# Altium schematic sheet Front_DisplayKey.SchDoc
size A4
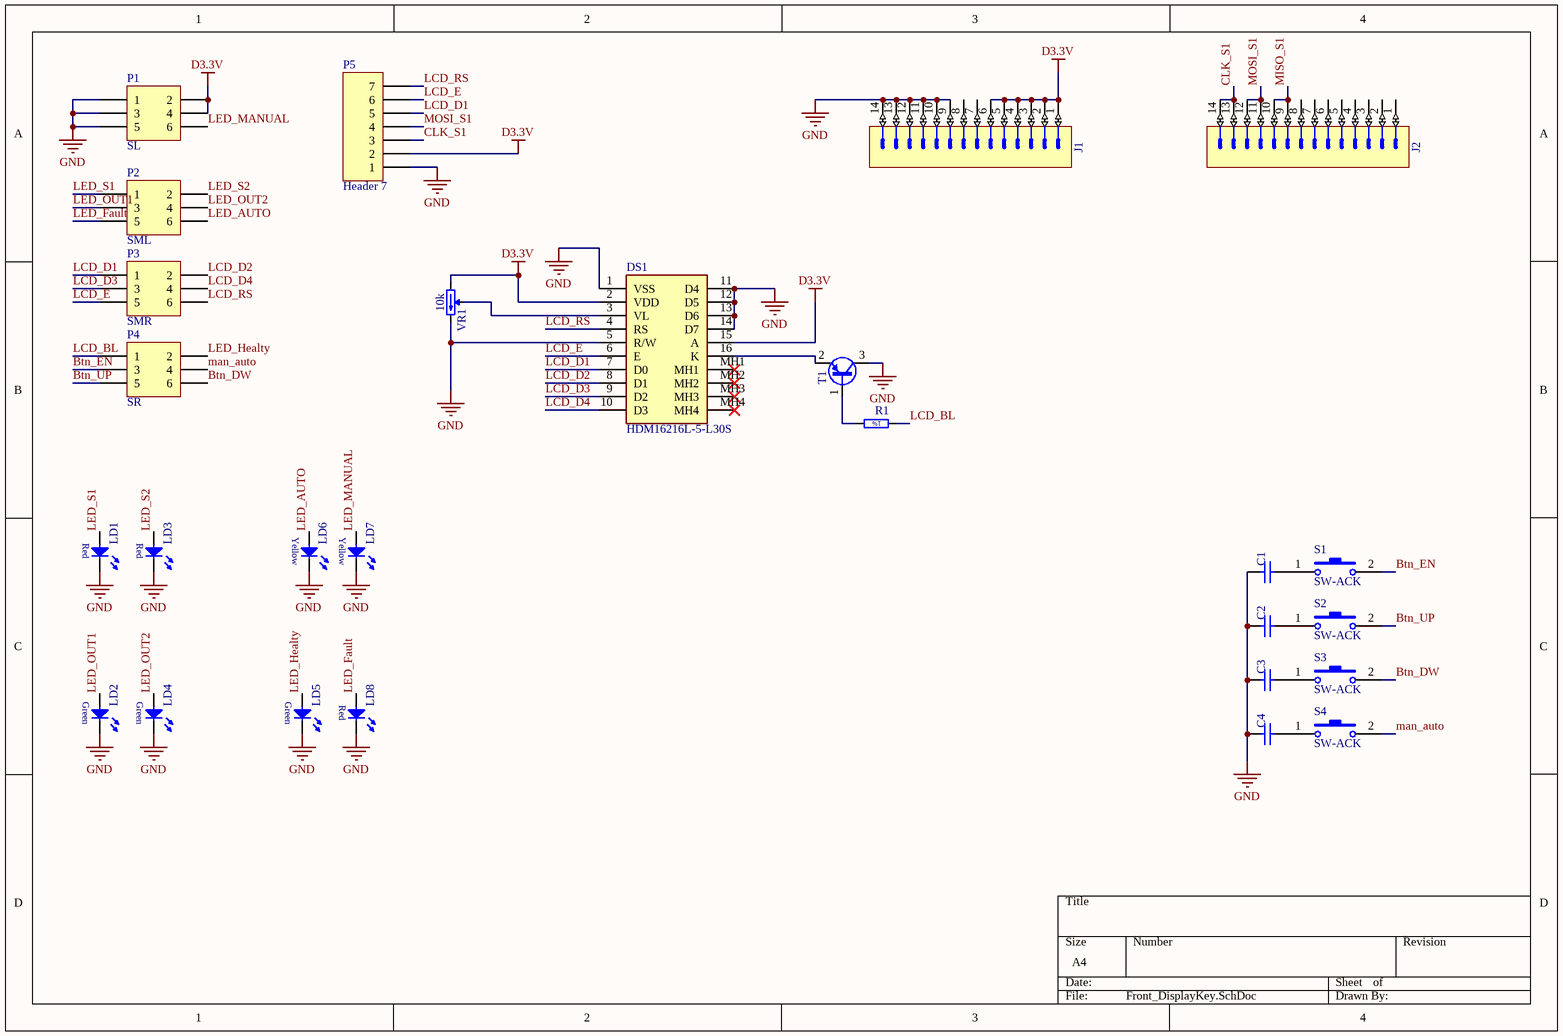
[diagram p0: Front_DisplayKey.SchDoc]

## Parts
C1  0.1uf  [CAPC2012X135N]  (value not drawn)
C2  0.1uf  [CAPC2012X135N]  (value not drawn)
C3  0.1uf  [CAPC2012X135N]  (value not drawn)
C4  0.1uf  [CAPC2012X135N]  (value not drawn)
DS1  HDM16216L-5-L30S  [HDM16216L5L30S]
J1  Header 14  [STELVIO-KONTEK_3910401114400]  (value not drawn)
J2  Header 14  [STELVIO-KONTEK_3910401114400]  (value not drawn)
LD1  Red  [LED_5MM_RED_1C-2A]  (value not drawn)
LD2  Green  [LED_3MM_GREEN_1C-2A]  (value not drawn)
LD3  Red  [LED_5MM_RED_1C-2A]  (value not drawn)
LD4  Green  [LED_3MM_GREEN_1C-2A]  (value not drawn)
LD5  Green  [LED_3MM_GREEN_1C-2A]  (value not drawn)
LD6  Yellow  [LED_3MM_YELLOW_1C-2A]  (value not drawn)
LD7  Yellow  [LED_3MM_YELLOW_1C-2A]  (value not drawn)
LD8  Red  [LED_5MM_RED_1C-2A]  (value not drawn)
P1  SL  [HDR2X3]
P2  SML  [HDR2X3]
P3  SMR  [HDR2X3]
P4  SR  [HDR2X3]
P5  Header 7  [HDR1X7]
R1  1k  [RESC2012X60N]  (value not drawn)
S1  SW-ACK  [SW_PB1]
S2  SW-ACK  [SW_PB1]
S3  SW-ACK  [SW_PB1]
S4  SW-ACK  [SW_PB1]
T1  MMBT3906LT1G  [SOT95P240X110-3N]  (value not drawn)
VR1  10k  [VR5]

## Nets
D3.3V: DS1.2(VDD) DS1.15(A) J1.1 J1.2 J1.3 J1.4 J1.5 J1.6 P1.2 P1.4 P5.2 VR1.1(CCW)
GND: C1.1 C2.1 C3.1 C4.1 DS1.1(VSS) DS1.5(R/W) DS1.11(D4) DS1.12(D5) DS1.13(D6) DS1.14(D7) J1.9 J1.10 J1.11 J1.12 J1.13 J1.14 LD1.1(C) LD2.1(C) LD3.1(C) LD4.1(C) LD5.1(C) LD6.1(C) LD7.1(C) LD8.1(C) P1.1 P1.3 P1.5 P5.1 T1.3(C) VR1.3(CW)
Btn_DW: P4.6 S3.2
Btn_EN: P4.3 S1.2
Btn_UP: P4.5 S2.2
CLK_S1: J2.13 J2.14 P5.3
LCD_BL: P4.1 R1.1
LCD_D1: DS1.7(D0) P3.1 P5.5
LCD_D2: DS1.8(D1) P3.2
LCD_D3: DS1.9(D2) P3.3
LCD_D4: DS1.10(D3) P3.4
LCD_E: DS1.6(E) P3.5 P5.6
LCD_RS: DS1.4(RS) P3.6 P5.7
LED_AUTO: LD6.2(A) P2.6
LED_Fault: LD8.2(A) P2.5
LED_Healty: LD5.2(A) P4.2
LED_MANUAL: LD7.2(A) P1.6
LED_OUT1: LD2.2(A) P2.3
LED_OUT2: LD4.2(A) P2.4
LED_S1: LD1.2(A) P2.1
LED_S2: LD3.2(A) P2.2
man_auto: P4.4 S4.2
MISO_S1: J2.9 J2.10
MOSI_S1: J2.11 J2.12 P5.4
NetC1_2: C1.2 S1.1
NetC2_2: C2.2 S2.1
NetC3_2: C3.2 S3.1
NetC4_2: C4.2 S4.1
NetDS1_3: DS1.3(VL) VR1.2(W)
NetDS1_16: DS1.16(K) T1.2(E)
NetR1_2: R1.2 T1.1(B)

Not connected (* = marked no-connect by the designer): DS1 MH1* MH2* MH3* MH4*; J1 7 8; J2 1 2 3 4 5 6 7 8

## Notes on the sheet
- (in symbol R0805_1K_1%_0.125W_100PPM) 1%

## Library data of the parts
C1-C4 = CC0805_100NF_50V_10%_X7R: 0092-0004-8; Part Description: SMD Multilayer Chip Ceramic Capacitor; Manufacturer: GENERIC; Manufacturer1 Part Number: B37941K5104K62; Value: 100nF; Voltage: 50V; TC: X7R; Tolerance: ±10%; Table: Capacitors SMD; Part Number: CC0805_100NF_50V_10%_X7R; Component Kind: Standard; Component Type: Standard; Pin Count: 2; Status: Preferred; Manufacturer Part Number: CC0805_100NF_50V_10%_X7R; Case: 0805; Mounted: Yes; Socket: No; SMD: Yes; Manufacturer1 Example: EPCOS; Manufacturer1 ComponentHeight: 1.35mm; HelpURL: \\cern.ch\dfs\Applications\Altium\Datasheets\CC0805_X7R_EPCOS.pdf; Author: CERN DEM JLC; CreateDate: 3/12/2550; LatestRevisionDate: 3/12/2550
DS1 = HDM16216L-5-L30S: Display; Manufacturer_Name: Hantronix; Datasheet Link: https://componentsearchengine.com//HDM16216L-5-L30S.pdf; Height: 14.5mm; Manufacturer_Part_Number: HDM16216L-5-L30S; Mouser Part Number: HDM16216L-5-L30S; Mouser Price/Stock: https://www.mouser.co.uk/ProductDetail/Hantronix/HDM16216L-5-L30S?qs=NSR9MB9Qqxa1fDGN5rUO%252Bw%3D%3D
J1 J2 = STELVIO-KONTEK_3910401114400: Connector 14 Male; Part Description: 14 Contacts - Pitch 2.54mm - Dual Row Right Angle Strip Header - Insulator 1.7mm; Table: STELVIO-KONTEK COMATEL; Part Number: STELVIO-KONTEK_3910401114400; Component Kind: Standard; Component Type: Standard; Pin Count: 14; Family: Header 14; Mounted: Yes; Socket: No; SMD: No; Status: None; Manufacturer: STELVIO-KONTEK; Manufacturer Part Number: 3910401114400; ComponentHeight: 5.7mm; HelpURL: \\cern.ch\dfs\Applications\Altium\Datasheets\STELVIO-KONTEK_3910401114400.pdf; Author: CERN DEM JLC; CreateDate: 29/8/2556; LatestRevisionDate: 29/8/2556
LD1 LD3 LD8 = LED_AVAGO_HLMP-3301: LED Red 1C 2A; Part Description: 5mm High Efficiency Red LED; Manufacturer: AVAGO TECHNOLOGIES; Table: LEDs & Displays; Part Number: LED_AVAGO_HLMP-3301; Component Kind: Standard; Component Type: Standard; Color: Red; PackageDescription: LED, Red, Body Dia. 5.08mm, Pin spacing 2.54mm; Manufacturer Part Number: HLMP-3301; Pin Count: 2; Mounted: Yes; Socket: No; SMD: No; ComponentHeight: 9.19mm(min); HelpURL: \\cern.ch\dfs\Applications\Altium\Datasheets\LED_AVAGO_HLMP-3301.pdf; Author: CERN DEM JLC; CreateDate: 12/6/2551; LatestRevisionDate: 17/3/2553
LD2 LD4 LD5 = LED_AVAGO_HLMP-1790: LED Green 1C 2A; Part Description: 3mm Green LED; Manufacturer: AVAGO TECHNOLOGIES; Table: LEDs & Displays; Part Number: LED_AVAGO_HLMP-1790; Component Kind: Standard; Component Type: Standard; Color: Green; PackageDescription: LED, Green, Body Dia. 3.43 mm, Pin spacing 2.54mm; Manufacturer Part Number: HLMP-1790; Pin Count: 2; Mounted: Yes; Socket: No; SMD: No; ComponentHeight: 6.35mm(min); HelpURL: \\cern.ch\dfs\Applications\Altium\Datasheets\LED_AVAGO_HLMP-1790.pdf; Author: CERN DEM JLC; CreateDate: 12/6/2551; LatestRevisionDate: 17/3/2553
LD6 LD7 = LED_AVAGO_HLMP-1719: LED Yellow 1C 2A; Part Description: 3mm Yellow LED; Manufacturer: AVAGO TECHNOLOGIES; Table: LEDs & Displays; Part Number: LED_AVAGO_HLMP-1719; Component Kind: Standard; Component Type: Standard; Color: Yellow; PackageDescription: LED, Yellow, Body Dia. 3.43 mm, Pin spacing 2.54mm; Manufacturer Part Number: HLMP-1719; Pin Count: 2; Mounted: Yes; Socket: No; SMD: No; ComponentHeight: 6.35mm(min); HelpURL: \\cern.ch\dfs\Applications\Altium\Datasheets\LED_AVAGO_HLMP-1719.pdf; Author: CERN DEM JLC; CreateDate: 12/6/2551; LatestRevisionDate: 17/3/2553
P1-P4 = Header 3X2: Header, 3-Pin, Dual row; LatestRevisionDate: 17-Jul-2002; LatestRevisionNote: Re-released for DXP Platform.; Publisher: Altium Limited
P5 = Header 7: Header, 7-Pin; LatestRevisionDate: 17-Jul-2002; LatestRevisionNote: Re-released for DXP Platform.; Publisher: Altium Limited
R1 = R0805_1K_1%_0.125W_100PPM: Resistor - 1%; Part Description: General Purpose Thick Film Chip Resistor; Manufacturer: GENERIC; Manufacturer1 Part Number: NRC10F1001TRF; Power: 0.125W; TC: ±100ppm/°C; Table: Resistors SMD; Part Number: R0805_1K_1%_0.125W_100PPM; Component Kind: Standard; Component Type: Standard; Pin Count: 2; Value: 1k; Status: Preferred; Tolerance: ±1%; Manufacturer Part Number: R0805_1K_1%_0.125W_100PPM; Case: 0805; Mounted: Yes; Socket: No; SMD: Yes; Manufacturer1 Example: NIC COMPONENT; Manufacturer1 ComponentHeight: 0.6mm; HelpURL: \\cern.ch\dfs\Applications\Altium\Datasheets\R0805_NIC_NRC.pdf; Author: CERN DEM JLC; CreateDate: 3/12/2550; LatestRevisionDate: 13/3/2551
S1-S4 = SW-PB: Switch; Published: 24-Mar-1999; LatestRevisionDate: 17-Jul-2002; LatestRevisionNote: Re-released for DXP Platform.; PackageReference: SPST-2; Publisher: Altium Limited; PackageDescription: Switch; 2 Leads
T1 = BSR18A: 0235-0223-4; Part Number: BSR18A; Part Description: 40V 200mA PNP General-Purpose Amplifier; Manufacturer: FAIRCHILD SEMICONDUCTOR; Table: Transistors; Component Kind: Standard; Component Type: Standard; Device: BSR18A; PackageDescription: SOT23 3-Leads, Pitch 0.95mm - Body 1.4x3mm, IPC Medium Density; Manufacturer Part Number: BSR18A; Pin Count: 3; Case: SOT23-3; Mounted: Yes; Socket: No; SMD: Yes; ComponentHeight: 1.3mm; HelpURL: \\cern.ch\dfs\Applications\Altium\Datasheets\BSR18A.pdf; Author: CERN DEM JLC; CreateDate: 15/5/2551; LatestRevisionDate: 15/5/2551
VR1 = TRIM_12T_100K_BOURNS_3266W-1-104LF: 0141-0259-5; Part Description: 12 Turn Trimming Potentiometer (Top Adjustement); Manufacturer: BOURNS; Value: 100k; Power: 0.25W; TC: ?100ppm/?C; Tolerance: ?10%; Table: Potentiometers THD; Part Number: TRIM_12T_100K_BOURNS_3266W-1-104LF; Component Kind: Standard; Component Type: Standard; Footprint: TRIM_BOURNS_3266W; Pin Count: 3; Manufacturer Part Number: 3266W-1-104LF; Case: 3266W; Mounted: Yes; Socket: No; SMD: No; ComponentHeight: 7.75mm; HelpURL: \\cern.ch\dfs\Applications\Altium\Datasheets\TRIM_BOURNS_3266W.pdf; Author: CERN DEM JLC; CreateDate: 10/6/2551; LatestRevisionDate: 28/11/2555